# Altium schematic sheet Controllers.SchDoc
size A4; SheetNumber: 4; SheetTotal: 7
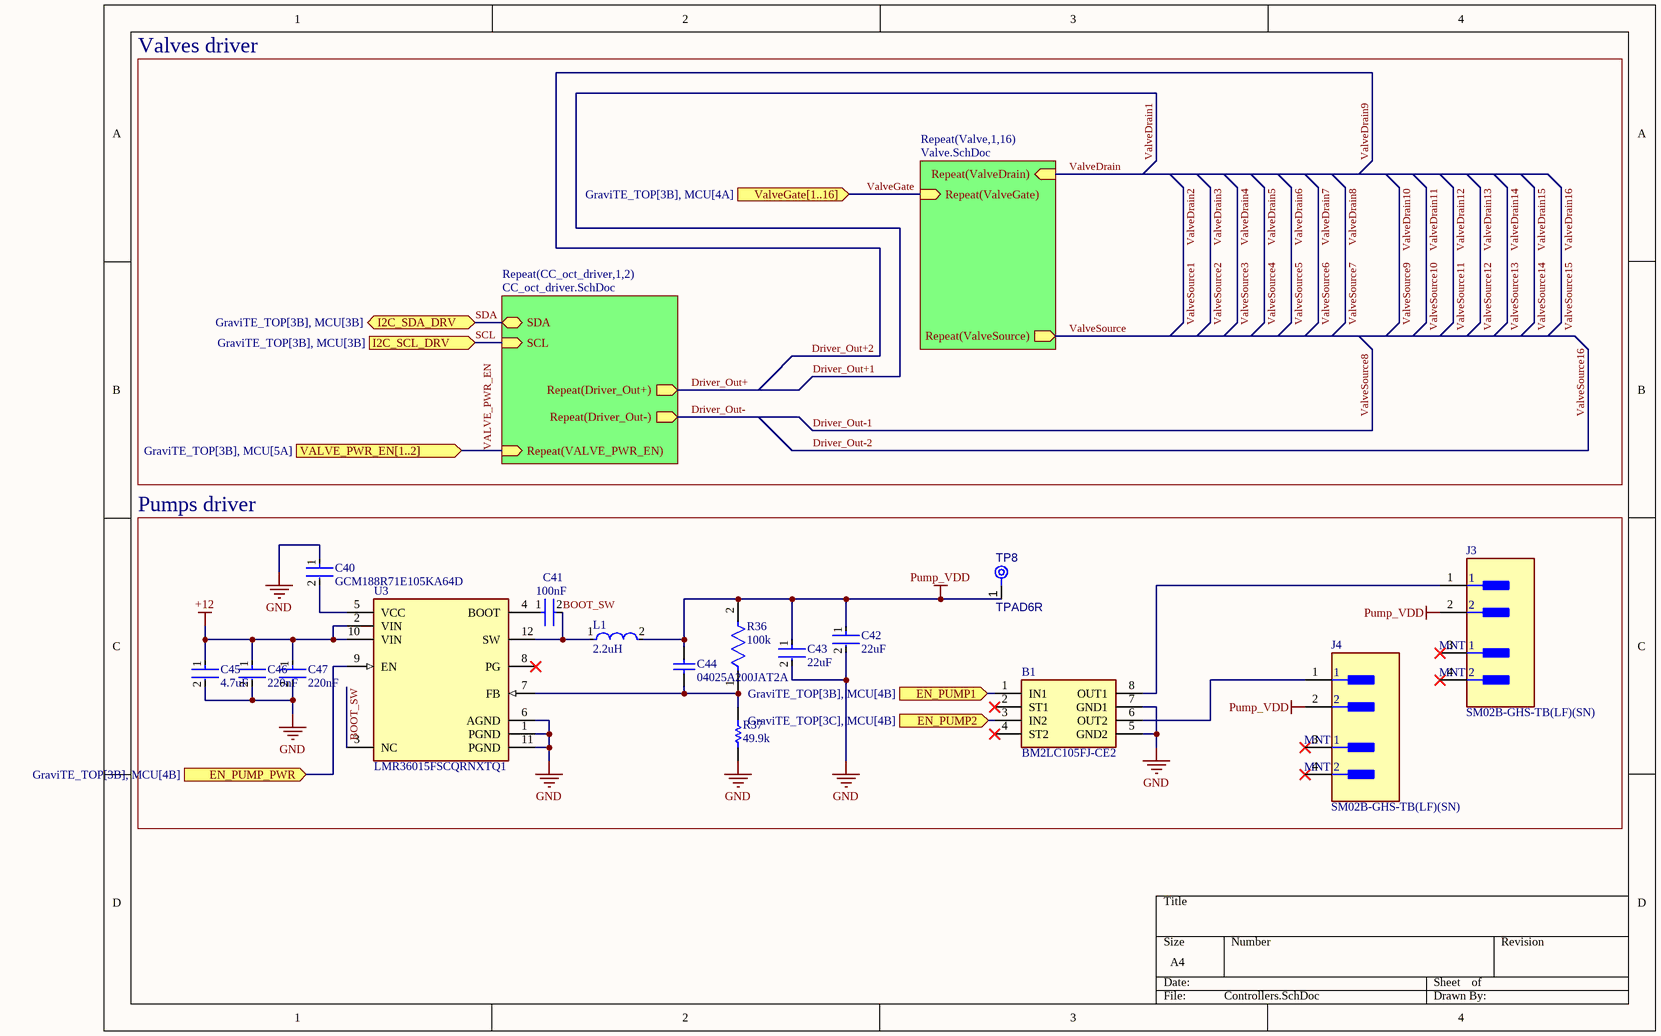
[diagram p0: Controllers.SchDoc]

## Parts
B1  BM2LC105FJ-CE2  [SOIC127P600X165-8N]
C40  GCM188R71E105KA64D  [FP-GCM188-0_1-MFG]
C41  100nF  [FP-GCM155-0_05-IPC_C]
C42  22uF  [FP-CGA5L-0_3-0_1-IPC_A]
C43  22uF  [FP-CGA5L-0_3-0_1-IPC_A]
C44  04025A200JAT2A  [CAPC1005X56X25NL10T15]
C45  4.7uF  [FP-GCM21B-0_2-e0_2_0_7-IPC_B]
C46  220nF  [FP-GCM188-0_1-IPC_B]
C47  220nF  [FP-GCM188-0_1-IPC_B]
J3  SM02B-GHS-TB(LF)(SN)  [FP-SM02B-GHS-TB_LF_SN-MFG]
J4  SM02B-GHS-TB(LF)(SN)  [FP-SM02B-GHS-TB_LF_SN-MFG]
L1  2.2uH  [FP-MLP2520S-MFG]
R36  100k  [FP-RMCF0402-IPC_C]
R37  49.9k  [RESC1005X40X25LL05T05]
TP8  TPAD6R  [TP06R]  (no BOM)
U3  LMR36015FSCQRNXTQ1  [FP-RNX0012B-MFG]

## Blocks framed on the sheet
Pumps driver: B1 C40-C47 J3 J4 L1 R36 R37 TP8 U3

## Sub-sheets
Repeat(CC_oct_driver,1,2) = CC_oct_driver.SchDoc: Repeat(Driver_Out+) (out), Repeat(VALVE_PWR_EN) (in), Repeat(Driver_Out-) (out), SDA (bidir), SCL (in)
Repeat(Valve,1,16) = Valve.SchDoc: Repeat(ValveDrain) (in), Repeat(ValveGate) (in), Repeat(ValveSource) (out)

## Ports
EN_PUMP1 (in, see GraviTE_TOP[3B], MCU[4B]), EN_PUMP2 (in, see GraviTE_TOP[3C], MCU[4B]), EN_PUMP_PWR (in, see GraviTE_TOP[3B], MCU[4B]), I2C_SCL_DRV (in, see GraviTE_TOP[3B], MCU[3B]), I2C_SDA_DRV (bidir, see GraviTE_TOP[3B], MCU[3B]), VALVE_PWR_EN[1..2] (in, see GraviTE_TOP[3B], MCU[5A]), ValveGate[1..16] (in, see GraviTE_TOP[3B], MCU[4A])

## Nets
+12: C45.1 C46.1 C47.1 U3.2(VIN) U3.10(VIN)
GND: B1.5(GND2) B1.7(GND1) C40.1 C42.2 C43.2 C45.2 C46.2 C47.2 R37.1 U3.1(PGND) U3.6(AGND) U3.11(PGND)
Pump_VDD: C42.1 C43.1 C44.2 J3.2 J4.2 L1.2 R36.2 TP8.1(TP)
BOOT_SW: C41.2 L1.1 U3.3(NC) U3.12(SW)
Driver_Out+: sheet Repeat(CC_oct_driver,1,2)/Repeat(Driver_Out+)
Driver_Out-: sheet Repeat(CC_oct_driver,1,2)/Repeat(Driver_Out-)
EN_PUMP1: B1.1(IN1) ; port EN_PUMP1
EN_PUMP2: B1.3(IN2) ; port EN_PUMP2
EN_PUMP_PWR: U3.9(EN) ; port EN_PUMP_PWR
SCL: port I2C_SCL_DRV, sheet Repeat(CC_oct_driver,1,2)/SCL
SDA: port I2C_SDA_DRV, sheet Repeat(CC_oct_driver,1,2)/SDA
VALVE_PWR_EN: sheet Repeat(CC_oct_driver,1,2)/Repeat(VALVE_PWR_EN)
ValveDrain: sheet Repeat(Valve,1,16)/Repeat(ValveDrain)
ValveGate: sheet Repeat(Valve,1,16)/Repeat(ValveGate)
ValveSource: sheet Repeat(Valve,1,16)/Repeat(ValveSource)
NetB1_6: B1.6(OUT2) J4.1
NetB1_8: B1.8(OUT1) J3.1
NetC40_2: C40.2 U3.5(VCC)
NetC41_1: C41.1 U3.4(BOOT)
NetC44_1: C44.1 R36.1 R37.2 U3.7(FB)

Not connected (* = marked no-connect by the designer): B1 2(ST1)* 4(ST2)*; J3 3(MNT_1)* 4(MNT_2)*; J4 3(MNT_1)* 4(MNT_2)*; U3 8(PG)*

## Notes on the sheet
- Valves driver

## Library data of the parts
B1 = BM2LC105FJ-CE2: Smart Low Side Switch ICs; Manufacturer_Name: ROHM Semiconductor; Geometry.Height: 1.65mm; Mouser Part Number: 755-BM2LC105FJ-CE2; Mouser Price/Stock: https://www.mouser.co.uk/ProductDetail/ROHM-Semiconductor/BM2LC105FJ-CE2?qs=YCa%2FAAYMW02vvU7sqt7v8g%3D%3D; Manufacturer_Part_Number: BM2LC105FJ-CE2; Datasheet Link: https://www.mouser.de/datasheet/2/348/bxxlc105fj-c-e-1807787.pdf
C40 = CMP-2006-02363-4: Manufacturer Lifecycle Status: IN PRODUCTION; NexarPartId: 18909256; Dielectric: X7R; Material: Ceramic; Tolerance: 10%; Capacitance: 1µF; Voltage Rating: 25V; Thickness: 889µm; Max Operating Temperature: 125°C; Radiation Hardening: No; Weight: 6.293594mg; Lead Free: Lead Free; Mount: Surface Mount; Case Code (Imperial): 0603; REACH SVHC: No SVHC; Lifecycle Status: Production; Depth: 800µm; Min Operating Temperature: -55°C; Height: 800µm; Case Code (Metric): 1608; Case/Package: 0603; Voltage: 25V; Packaging: Cut Tape; Length: 1.6mm; Termination: SMD/SMT; Width: 787.4µm; Voltage Rating (DC): 25V; RoHS: Compliant; Schedule B: 8532240020, 8532240020; Ratings: AEC-Q200
C41 = CMP-2008-03711-3: Ceramic Capacitor for Automotive 100nF ±10% 16VDC X7R 0402 Paper T/R; Voltage Rating (DC): 16V; Termination: SMD/SMT; Length: 1mm; Voltage: 16V; Mount: Surface Mount; Packaging: Tape and Reel; Case Code (Metric): 1005; Case/Package: 0402; Voltage Rating: 16V; Min Operating Temperature: -55°C; Case Code (Imperial): 0402; Ratings: AEC-Q200; Height: 0.5mm; Tolerance: 10%; Width: 0.02inch; Radiation Hardening: No; Depth: 0.5mm; Capacitance: 100nF; Max Operating Temperature: 125°C; Package Quantity: 1; REACH SVHC: No SVHC; Thickness: 0.022inch; Dielectric: X7R; Lead Free: Lead Free
C42 C43 = CMP-08246-001863-1: Cap Ceramic 22uF 16V X5R 20% Pad SMD 1206 +85°C Automotive T/R; Height: 1.6mm; Weight: 0.000571oz; Lead Free: Lead Free; Min Operating Temperature: -55°C; Max Operating Temperature: 85°C; Case Code (Metric): 3216; Capacitance: 22uF; Case Code (Imperial): 1206; Voltage Rating: 16V; Packaging: Tape and Reel; Voltage Rating (DC): 16V; Ratings: AEC-Q200; Length: 0.126inch; Case/Package: 1206; Width: 0.063inch; Package Quantity: 2000; Dielectric: X5R; Thickness: 0.071inch; Mount: Surface Mount; Tolerance: 20%; Termination: SMD/SMT
C44 = CMP-2008-02607-1: Manufacturer: AVX Interconnect / Elco; Part Number: 04025A200JAT2A
C45 = CMP-06035-045423-1: Ceramic Capacitor for Automotive 4.7uF ±10% 25VDC X7S 0805 Embossed T/R
C46 C47 = CMP-2006-02366-2: Ceramic Capacitor for Automotive 220nF  ±10% 25VDC X7R 0603 Paper T/R; Voltage: 25V; Capacitance: 220nF; Mount: Surface Mount; Ratings: AEC-Q200; Case/Package: 0603; Packaging: Tape and Reel; Radiation Hardening: No; Dielectric: X7R; Case Code (Imperial): 0603; Max Operating Temperature: 125°C; Min Operating Temperature: -55°C; Depth: 0.8mm; Termination: SMD/SMT; Package Quantity: 1; Case Code (Metric): 1608; Thickness: 0.035inch; Voltage Rating: 25V; Tolerance: 10%; Voltage Rating (DC): 25V; Height: 0.8mm; Lead Free: Lead Free; Length: 1.6mm; Width: 0.031inch
J3 J4 = CMP-2000-07076-2: CONN HEADER SMD R/A 2POS 1.25MM; Voltage Rating: 50V; Number of Positions: 2; Pitch: 0.049inch; Current Rating: 1A; Connector Type: Outer Shroud Contact; Number of Rows: 1; Contact Material: Bronze; Termination: Solder; Color: Natural; Package Quantity: 2500; Mount: Surface Mount; Housing Color: Natural; Number of Contacts: 2; Packaging: Tape and Reel; Lead Free: Lead Free; Housing Material: Nylon; Orientation: Right Angle; Contact Type: Male Pin; Contact Plating: Tin; Series: GH; Fastening Type: Latch
L1 = CMP-08253-000030-1: Shielded Multilayer Inductor 2.2uH ±20% 1200mA 143mΩ SMD 1008; Test Frequency: 2MHz; Current Rating: 1.2A; DC Resistance (DCR): 143mR; Inductance: 2.5uH; Core Material: Ferrite; Packaging: Tape and Reel; Height - Seated (Max): 0.039inch; Tolerance: 20%; Case Code (Imperial): 1008; Case Code (Metric): 2520; Max Operating Temperature: 125°C; Shielding: Shielded; Package Quantity: 3000; Min Operating Temperature: -40°C; Mount: Surface Mount; RoHS Compliant: Yes; Width: 0.079inch; Case/Package: 1008; Length: 0.098inch
R36 = CMP-2000-06984-2: 100kΩ ±1% 0.063W 0402 Thick Film Chip Resistor AEC-Q200 compliant; Max Power Dissipation: 63mW; Resistance: 100kR; Temperature Coefficient: 100ppm/°C; Power Rating: 62.5mW; Packaging: Tape and Reel; Size Code: 0402; Resistor Type: Thick Film; Features: Automotive AEC-Q200; Case Code (Metric): 1005; RoHS Compliant: Yes; Length: 1mm; Radiation Hardening: No; Military Standard: Not; Case Code (Imperial): 0402; Depth: 0.5mm; Max Operating Temperature: 155°C; Lead Free: Lead Free; Case/Package: 0402; Tolerance: 1%; Construction: Rectangular; Number of Terminations: 2; Mount: Surface Mount; Min Operating Temperature: -55°C; Width: 0.02inch; Series: RMCF; Contact Plating: Tin; Height: 0.016inch
R37 = CMP-2002-00967-3: Chip Resistor, 49.9 KOhm, +/- 1%, 100 mW, -55 to 155 degC, 0402 (1005 Metric), RoHS, Tape and Reel; Manufacturer: Basic Passives; PartNumber: ERJ-2RKF4992X; Case\/Package: 0402; Power Rating: 100 mW; Voltage Rating: 50 V; Pins: 2; Case Code (Imperial): 0402; Package Quantity: 10000; REACH SVHC: No SVHC; DatasheetVersion: 04/2015; Width: 0.5 mm; Height: 0.35 mm; Case Code (Metric): 1005; ComponentLink2URL: http://industrial.panasonic.com/cdbs/www-data/pdf/RDA0000/AOA0000C86.pdf; Mounting Technology: Surface Mount; ComponentLink1Description: Manufacturer URL; Resistance: 49.9 KOhm; PackageDescription: 2-Pin Surface Mount Device, Body 1 x 0.5 mm; Radiation Hardening: No; RoHSCompliant: true; PackageReference: 0402; Max Operating Temperature: 155 degC; Packaging: Tape and Reel; Mount: Surface Mount; Tolerance: 1%; Min Operating Temperature: -55 degC; ComponentLink1URL: http://www.panasonic.com/; ComponentLink2Description: Datasheet; Length: 1 mm
TP8 = CMP-00028-00002-2: 0.6mm round; Pins: 1
U3 = CMP-04918-000451-1: IC REG BUCK ADJ 1.5A 12VQFN; RoHS Compliant: Yes